# EAGLE design Cactus_ATV (EAGLE 9.6.2)
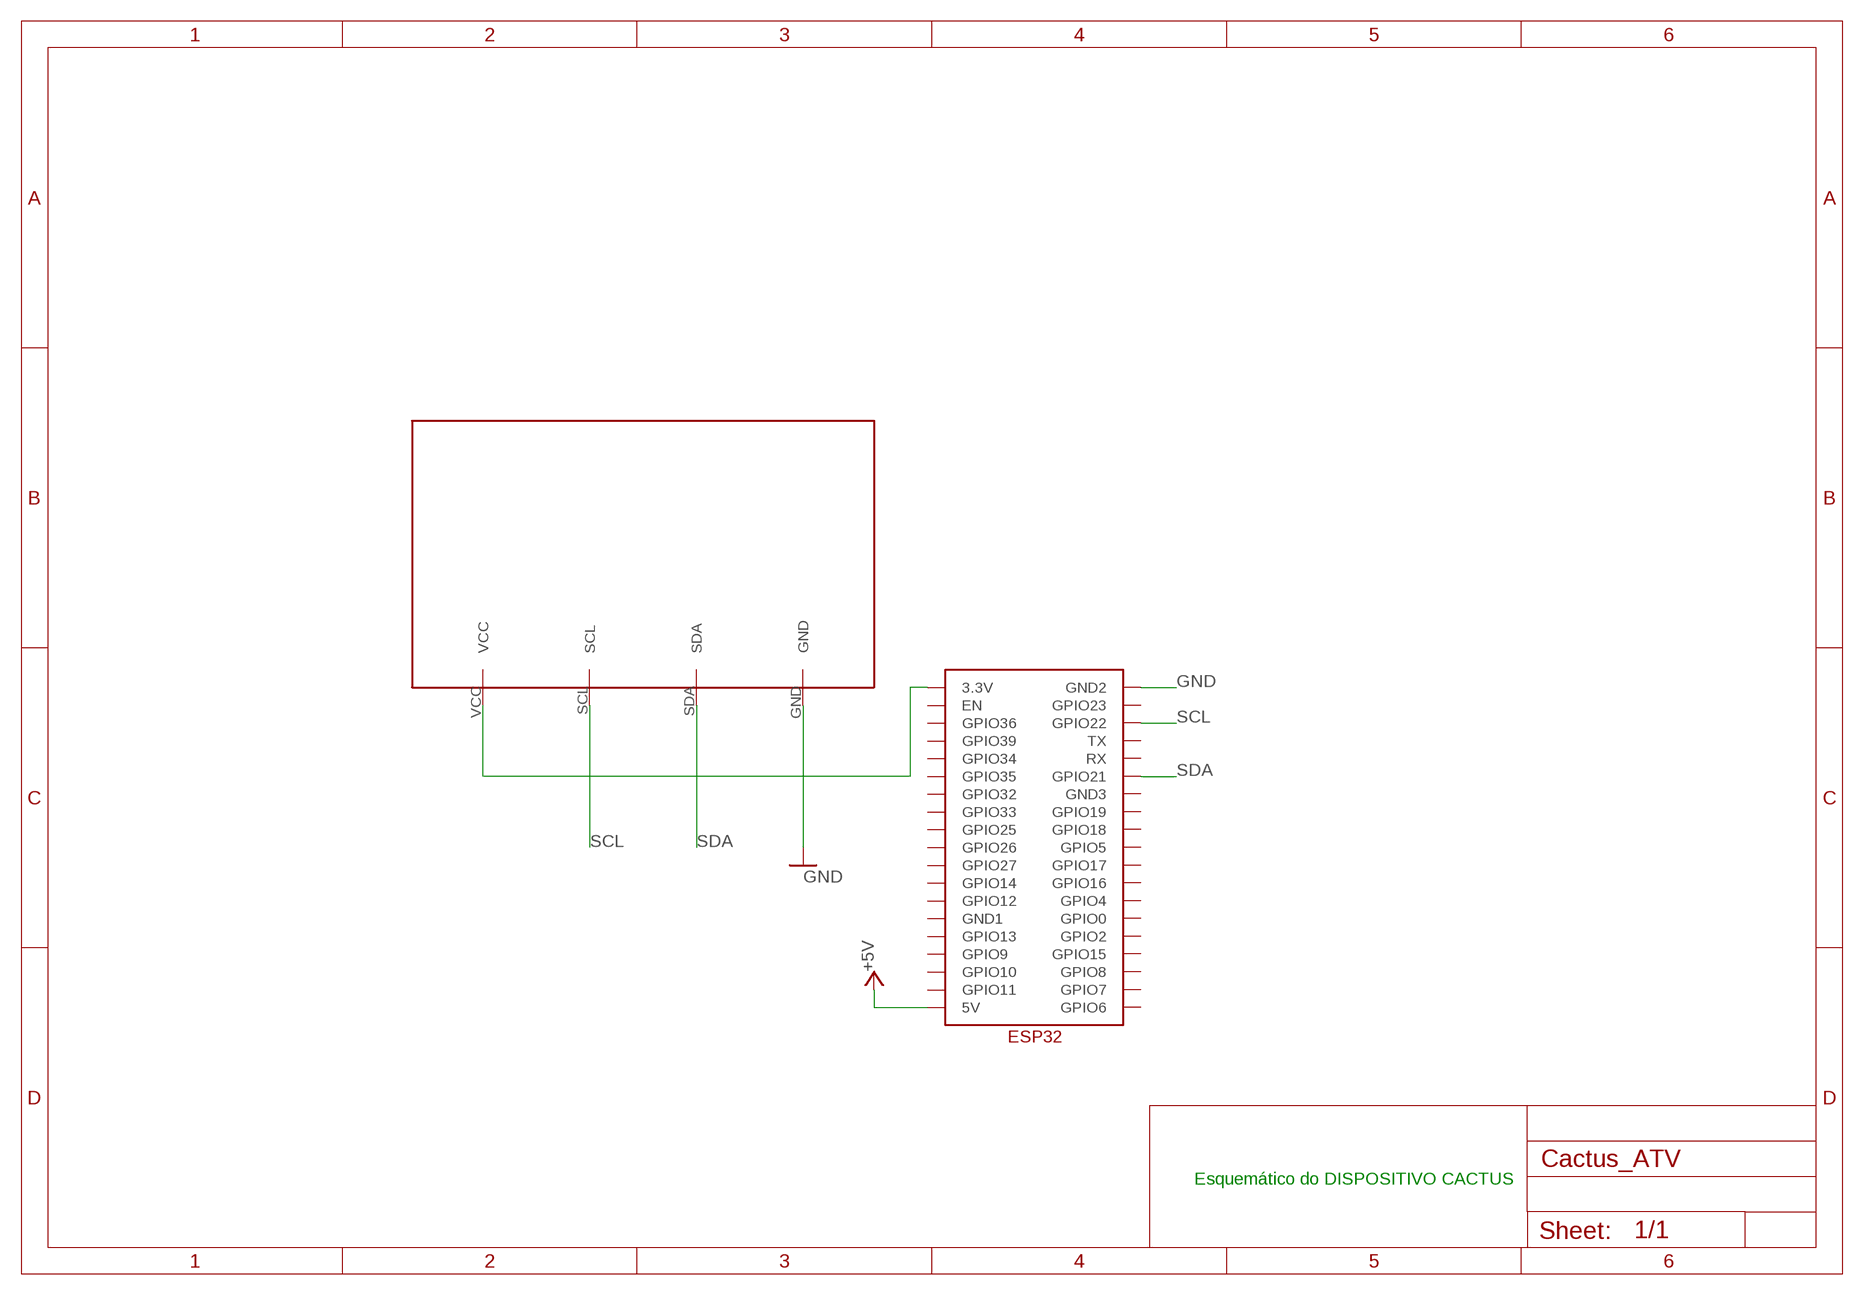
[diagram p0: schematic, sheet 1]

## Parts
U$1  DISPOSITIVO_CACTUS  [DISPOSITIVO_CACTUS]
U$2  ESP32  [ESP32]

## Nets
+5V: U$2.5V
GND: U$1.GND U$2.GND2
N$2: U$1.VCC U$2.3.3V
SCL: U$1.SCL U$2.GPIO22
SDA: U$1.SDA U$2.GPIO21
Unconnected: U$2.EN U$2.GND1 U$2.GND3 U$2.GPIO0 U$2.GPIO2 U$2.GPIO4 U$2.GPIO5 U$2.GPIO6 U$2.GPIO7 U$2.GPIO8 U$2.GPIO9 U$2.GPIO10 U$2.GPIO11 U$2.GPIO12 U$2.GPIO13 U$2.GPIO14 U$2.GPIO15 U$2.GPIO16 U$2.GPIO17 U$2.GPIO18 U$2.GPIO19 U$2.GPIO23 U$2.GPIO25 U$2.GPIO26 U$2.GPIO27 U$2.GPIO32 U$2.GPIO33 U$2.GPIO34 U$2.GPIO35 U$2.GPIO36 U$2.GPIO39 U$2.RX U$2.TX

## Notes on the sheet
- Esquemático do DISPOSITIVO CACTUS

## Library data of the parts
U$1 = DISPOSITIVO_CACTUS:DISPOSITIVO_CACTUS
U$2 = ESP32:ESP32

## Board
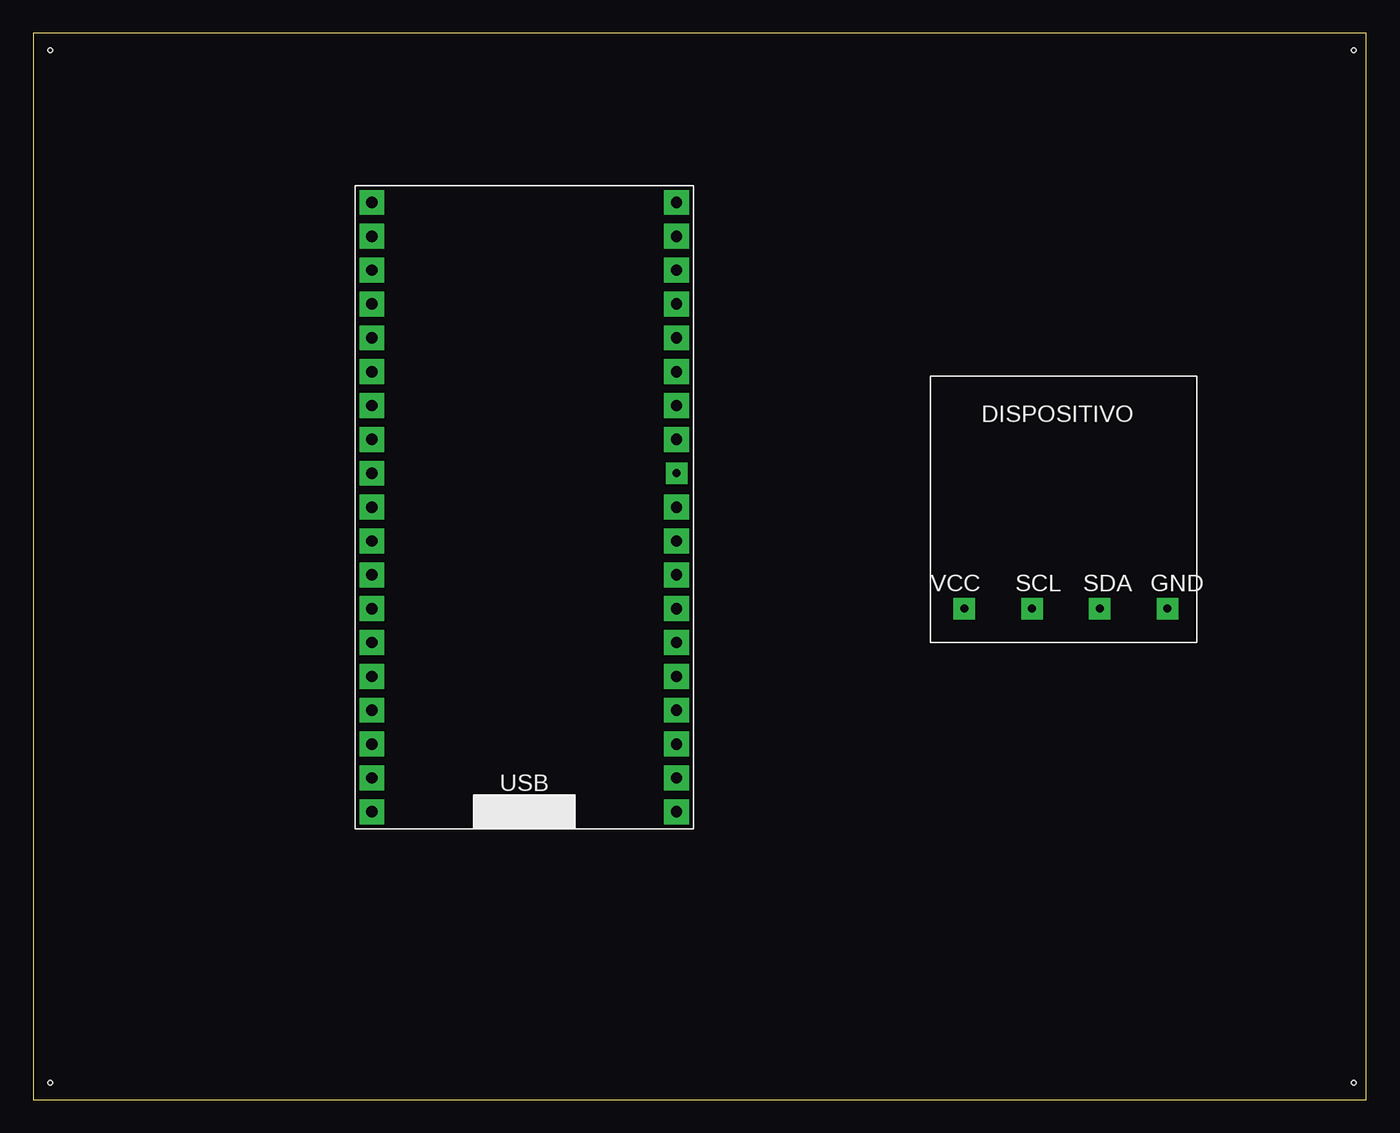
[diagram p1: board, top side]
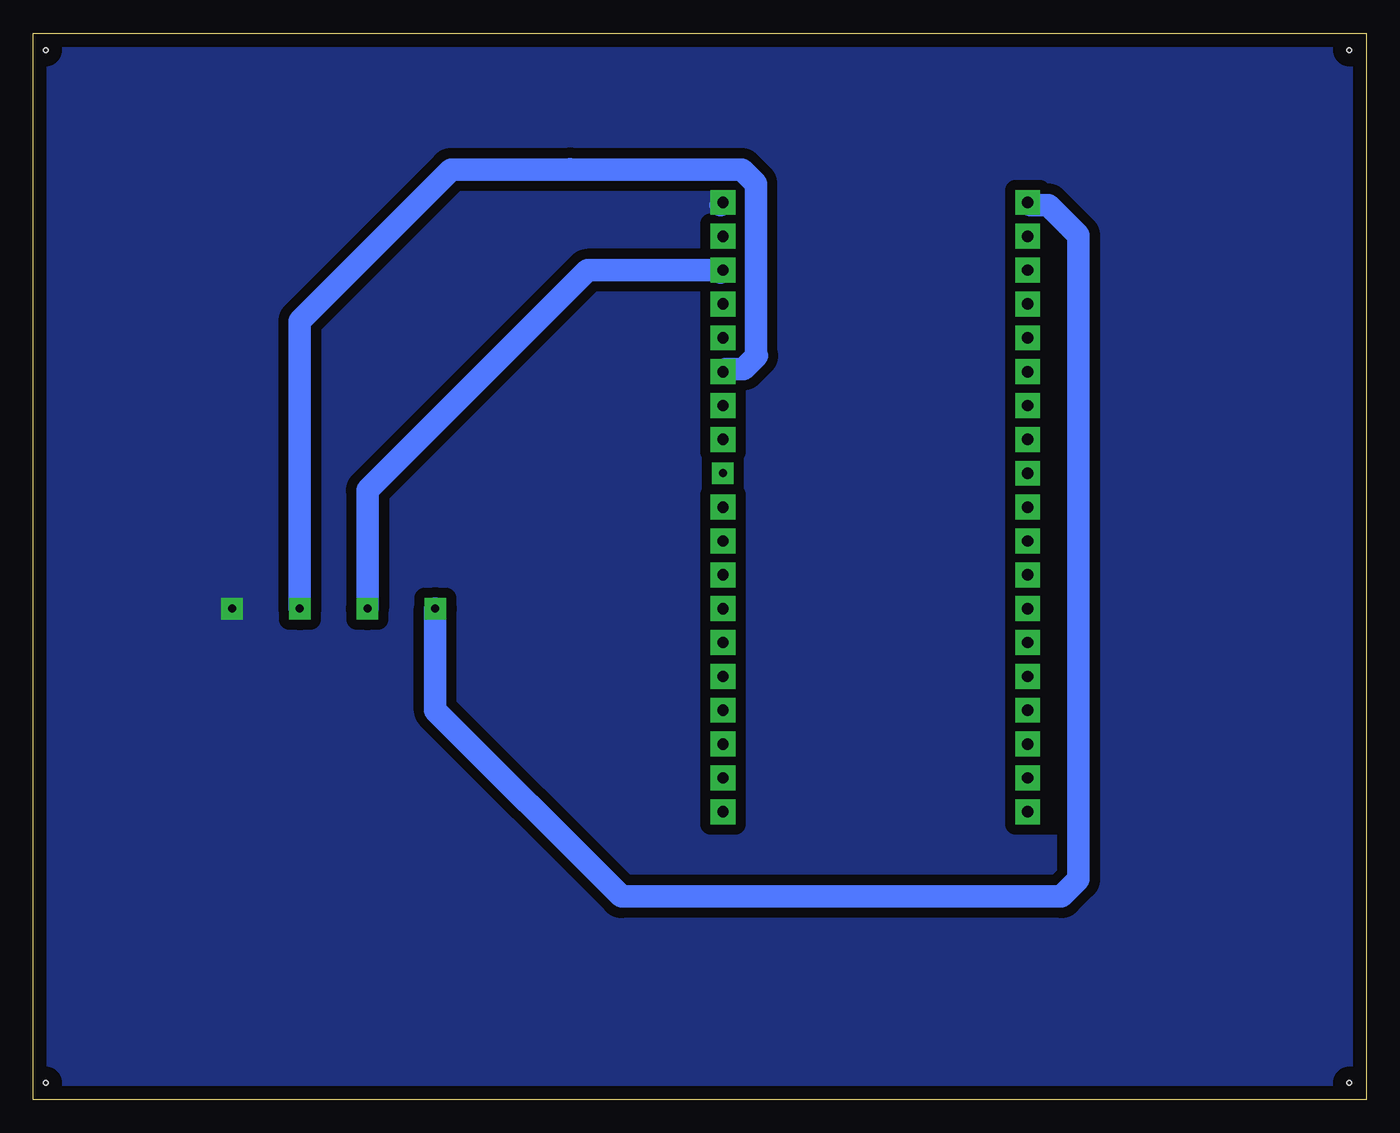
[diagram p2: board, bottom side, seen from below]

Size 100 x 80 mm. Coordinates in mm from the lower left corner, seen from the top.
Outline: 0,0 100,0 100,80 0,80 0,0
Copper layers (1*16): Top 0.035mm / dielectric 1.5mm / Bottom 0.035mm
Design rules "CACTUS_DEFAULT": minimum track width 1.7mm, minimum drill 1mm, track to track 30mil, track to pad 20mil, pad to pad 6mil, via to via 6mil, smd to smd 6mil, copper to edge 40mil, drill to drill 6mil, minimum pad ring 22mil, minimum via ring 22mil, stop-mask expansion 4mil, vias tented up to drill 0mil, thermal gap 0mil
Holes 0.35 mm at 1.27,1.27 99.06,78.74 99.06,1.27 1.27,78.74

### Footprints (pad centres in the part's own frame; a part is rotated, then mirrored left to right if it is on the bottom)
DISPOSITIVO_CACTUS = drill 0.6 square: GND 17.78,2.54; SCL 7.62,2.54; SDA 12.7,2.54; VCC 2.54,2.54
ESP32 = drill 0.85 square: 3.3V 1.27,46.99; 5V 1.27,1.27; EN 1.27,44.45; GND1 1.27,13.97; GND2 24.13,46.99; GND3 24.13,31.75; GPIO0 24.13,13.97; GPIO2 24.13,11.43; GPIO4 24.13,16.51; GPIO5 24.13,24.13; GPIO6 24.13,1.27; GPIO7 24.13,3.81; GPIO8 24.13,6.35; GPIO9 1.27,8.89; GPIO10 1.27,6.35; GPIO11 1.27,3.81; GPIO12 1.27,16.51; GPIO13 1.27,11.43; GPIO14 1.27,19.05; GPIO15 24.13,8.89; GPIO16 24.13,19.05; GPIO17 24.13,21.59; GPIO19 24.13,29.21; GPIO21 24.13,34.29; GPIO22 24.13,41.91; GPIO23 24.13,44.45; GPIO25 1.27,26.67; GPIO26 1.27,24.13; GPIO27 1.27,21.59; GPIO32 1.27,31.75; GPIO33 1.27,29.21; GPIO34 1.27,36.83; GPIO35 1.27,34.29; GPIO36 1.27,41.91; GPIO39 1.27,39.37; RX 24.13,36.83; TX 24.13,39.37 | drill 0.6 square: GPIO18 24.13,26.67

### Placement (x,y rotation side)
U$1  67.31,34.29 0 top
U$2  24.13,20.32 0 top

### Tracks (layer width: path | path; a pad name or v marks a point on that pad's centre or on a via)
GND
  Top 0.152: 85.04,36.88 U$1.GND | 48.31,67.21 U$2.GND2
  Bottom 1.7: U$2.GND2 48.46,67.11
  pour Bottom: 0,80 0,0 100,0 100,80
N$2
  Top 0.152: 69.8,36.88 U$1.VCC | 25.45,67.21 U$2.3.3V
  Bottom 1.7: U$2.3.3V 25.2,67.11 23.85,67.11 21.59,64.85 21.59,16.51 22.86,15.24 55.88,15.24 69.85,29.21 U$1.VCC
SCL
  Top 0.152: 74.83,36.88 U$1.SCL
  Bottom 1.7: 48.46,62.03 U$2.GPIO22 58.42,62.23 74.93,45.72 U$1.SCL
SDA
  Bottom 0.152: 80.01,36.88 U$1.SDA | 48.31,54.56 U$2.GPIO21
  Bottom 1.7: U$2.GPIO21 48.06,54.81 46.71,54.81 45.72,55.8 45.8,55.88 45.8,68.74 46.83,69.77 59.69,69.77 | 59.73,69.81 59.69,69.77 | 59.69,69.77 68.66,69.77 80.01,58.42 U$1.SDA